# Altium schematic sheet MAX1771.SchDoc
size A; SheetNumber: 4; SheetTotal: 8
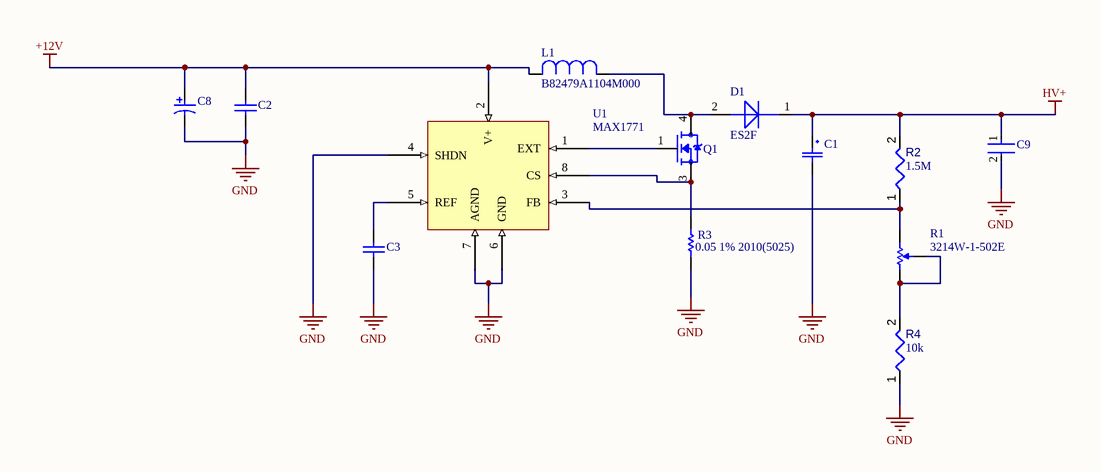
[diagram p0: MAX1771.SchDoc]

## Parts
C1  EEV-EB2E100Q  [CAP_UCD_10X10]  (value not drawn)
C2  12065C104KAT2A  [CAPC3216X94X50ML20T25]  (value not drawn)
C3  12065C104KAT2A  [CAPC3216X94X50ML20T25]  (value not drawn)
C8  TPSD107K010R0100  [AVX-7343-31_L]  (value not drawn)
C9  C1206C104KARACTU  [FP-C1206C-EB-MFG]  (value not drawn)
D1  ES2F  [DIOM5436X244N - duplicate]
L1  B82479A1104M000  [IND_EPCOS_B82479A1]
Q1  IRF740 D2PAK  [D2PAK]  (value not drawn)
R1  3214W-1-502E  [BOUR-3214W_V]
R2  value 1.5M  [RESC3216X60X45ML15T20]  (hidden comment: Resistor 1.5M +/-1% 1206 250 mW)
R3  0.05 1% 2010(5025)  [RESC2010(5025)_N]
R4  value 10k  [RESC3216X60X45ML15T20]  (hidden comment: Resistor 10k +/-1% 1206 250 mW)
U1  MAX1771  [8-SOIC]

## Nets
+12V: C2.1 C8.1 L1.2 U1.2(V+)
GND: C1.2 C2.2 C3.2 C8.2 C9.2 R3.2 R4.1 U1.4(SHDN) U1.6(GND) U1.7(AGND)
HV+: C1.1 C9.1 D1.1 R2.2
NetC3_1: C3.1 U1.5(REF)
NetD1_2: D1.2 L1.1 Q1.4(D)
NetQ1_1: Q1.1(G) U1.1(EXT)
NetQ1_3: Q1.3(S) R3.1 U1.8(CS)
NetR1_1: R1.1 R1.2 R4.2
NetR1_3: R1.3 R2.1 U1.3(FB)

## Library data of the parts
C1 = UUB2E4R7MNL1GS: Vendor: Nichicon; Built_By: EMA_Cory; SourceLibrary: Nichicon_2019-09-13; Type: DEV; Manufacturer_Part_Number: UUB2E4R7MNL1GS; Copyright: Copyright (C) 2018 Accelerated Designs. All rights reserved; RefDes: RefDes
C2 C3 = CMP-2000-05018-1: Chip Capacitor, Ceramic, 100 nF, 10%, 50 V, 1206, RoHS, Tape and Reel / 12065C104KAT2A; Manufacturer: AVX; Rated Voltage: 50V; Dielectric: X7R; Capacitance: 100nF; Datasheet URL: http://www.mouser.com/ds/2/40/cauto-360.pdf; Manufacturer URL: http://www.avx.com/; Datasheet Version: Sep-14; Tolerance (%): ±10%; Case Size/Dimension: 1206
C8 = CMP-2000-07298-1: Tantalum Capacitor, 100 uF, +/- 10%, 10 V, -55 to 125 degC, 2917 (7343 Metric), RoHS, Tape and Reel / TPSD107K010R0100; Manufacturer Size Code: D; Manufacturer: AVX; Voltage - Rated: 10V; Other Names: 478-1777-1; Featured Product: TPSCapacitors; Catalog Drawings: TPSSeriesSides; Online Catalog: TPSSeries; Type: Molded; Capacitance: 100µF; Product Training Modules: ComponentSolutionsforSmartMeterApplications; ESR (Equivalent Series Resistance): 100mOhm; Height - Seated (Max): 0.122"(3.10mm); Tolerance: ±10%; Standard Package: 1; Manufacturer URL: http://www.avx.com/; Mounting Technology: SurfaceMount; Series: TPS; Package / Case: 2917(7343Metric); Lead Spacing: -; Lifetime @ Temp.: -; Package Reference: 7343-31; Mounting Type: SurfaceMount; Size / Dimension: 0.287"Lx0.169"W(7.30mmx4.30mm); Operating Temperature: -55°C~125°C; Features: GeneralPurpose; Datasheet URL: http://datasheets.avx.com/TPS.pdf; Datasheet Version: 01/2017; Package Description: 2-Pin Surface Mount Device, Body 7.3 x 4.35 mm; Category: Capacitors; Packaging: CutTape(CT); Family: TantalumCapacitors
C9 = CMP-1037-04229-2: CAP CER 0.1UF 250V X7R 1206 / C1206C104KARACTU; Manufacturer: KEMET; Material: Ceramic; Temperature Coefficient: 15%; Description: C1206 0.10 μF X7R 10.00% 250 V; Value: 0.10 μF; Tolerance: 0.1; Automotive Grade: Grade 0; Mouser Description: Multilayer Ceramic Capacitors MLCC - SMD/SMT 250volts 0.1uF X7R 10%; Height: 0.88mm; Device Class L3: Ceramic Capacitors; Temperature Range Low: -55°C; Automotive: Yes; ComponentLink2Description: Datasheet; Category: Cap; RoHS: TRUE; Manufacturer Part Number: C1206C104KARACTU; Temperature Range High: +150°C; Package: C1206C-EB; Device Class L2: Capacitors; Voltage Rating: 250 V; Lead Free: Yes; Temperature Characteristic: X7R; Digikey Description: CAP CER 0.1UF 250V X7R 1206; ComponentLink2URL: https://content.kemet.com/datasheets/KEM_C1007_X8R_ULTRA_150C_SMD.pdf; Device Class L1: Passive Components; Ipc Land Pattern Name: CAPC320160X78; Temperature: -55°C to +150°C; Capacitance: 0.10 μF; Octopart: https://octopart.com/c1206c104karactu-kemet-193627
D1 = ES2F_1
L1 = B82479A1104M000: No Description Available; Vendor: Epcos; Built_By: EMA_UL_Team; SourceLibrary: Epcos_2010-01-01_Inductors; Type: DEV; Manufacturer_Part_Number: B82479A1104M000; Copyright: Copyright (C) 2021 Accelerated Designs. All rights reserved; RefDes: RefDes
R1 = CMP-2000-05579-1: 3214 - 5-Turn Trimpot(R) Trimming Potentiometer, 5 KOhm, +/- 10%, 0.25 W, -65 to 150 degC, RoHS, Tape and Reel; Manufacturer: Bourns; Temperature Coefficient: ±100ppm/°C; Power Rating: 250mW; No. of Turns: 5; Track Resistance: 5kohm; SVHC: NoSVHC(16-Jun-2014); Potentiometer Mounting: SMD; Manufacturer URL: http://www.bourns.com/; Resistance Tolerance: ±10%; Datasheet URL: http://www.bourns.com/docs/Product-Datasheets/3214.pdf; ROHS COMPLIANT: Yes; Mounting Technology: SurfaceMount; Datasheet Version: 05/2016; Package Reference: 3214W; Package Description: 3-Pin Surface Mount Device, Body 3.5 x 4.8 mm, Pitch 1.25 mm
R2 = CMP-009-00016-4: Chip Resistor, 1.5M Ohm, +/- 1%, 0.25 W, -55 to 155 degC, 1206 (3216 Metric); Power: 250mW; Voltage Rating: 200V; Max Operating Temperature: 155°C; Mounting Technology: SM; Case/Package: 1206; Pins: 2; Min Operating Temperature: -55°C; RoHS Compliant: True; Tolerance: 1%
R3 = CMP-1017-00397-1: 0.05.75W 1% 2010 (5025 Metric)  SMD / LR2010-R05FW; Case-EIA: 2010; Power: 0.75 W; Case-Metric: 5025; Value: 100.00 Ohm; Tolerance: 1 %; Technology: SMT
R4 = CMP-009-00016-4: Chip Resistor, 10 KOhm, +/- 1%, 0.25 W, -55 to 155 degC, 1206 (3216 Metric); Power: 250mW; Voltage Rating: 200V; Max Operating Temperature: 155°C; Mounting Technology: SM; Case/Package: 1206; Pins: 2; Min Operating Temperature: -55°C; RoHS Compliant: True; Tolerance: 1%